# Altium project iris-fpc-set1.PrjPcb
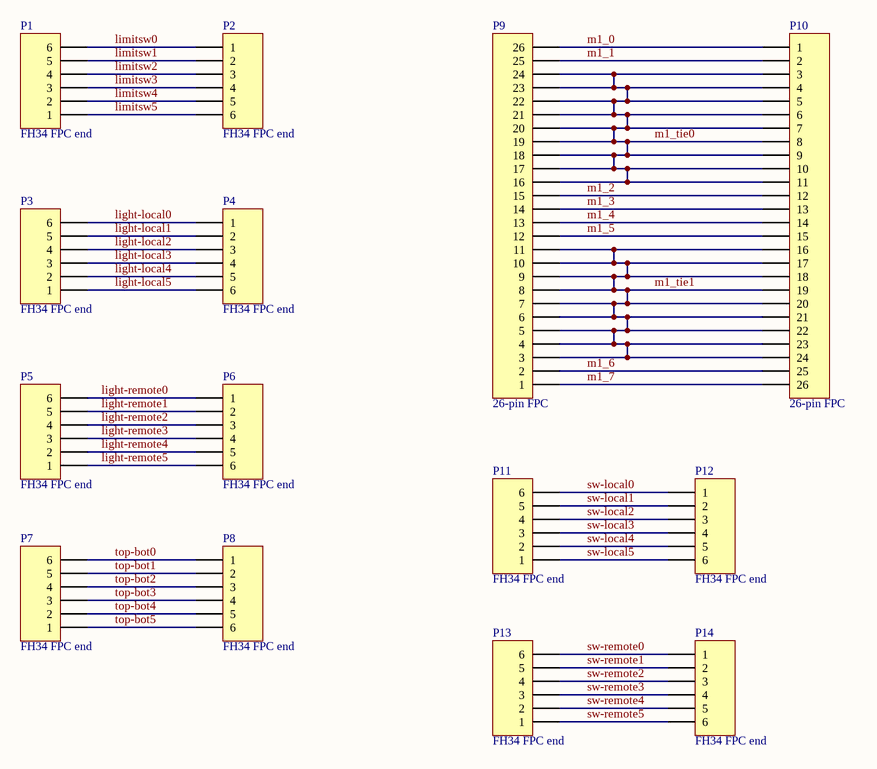
[diagram p0: wires.SchDoc]
1 sheet, 14 parts. Net scope: global (net labels, ports and power ports of the same name join across sheets).
Board file: iris-fpc-set1.PcbDoc

## Sheet wires.SchDoc
size A3; SheetNumber: 1; SheetTotal: 1

### Parts
P1  FH34 FPC end  [FPC-06-0.5MMP-0.3T-2.5MMS]
P2  FH34 FPC end  [FPC-06-0.5MMP-0.3T-2.5MMS]
P3  FH34 FPC end  [FPC-06-0.5MMP-0.3T-2.5MMS]
P4  FH34 FPC end  [FPC-06-0.5MMP-0.3T-2.5MMS]
P5  FH34 FPC end  [FPC-06-0.5MMP-0.3T-2.5MMS]
P6  FH34 FPC end  [FPC-06-0.5MMP-0.3T-2.5MMS]
P7  FH34 FPC end  [FPC-06-0.5MMP-0.3T-2.5MMS]
P8  FH34 FPC end  [FPC-06-0.5MMP-0.3T-2.5MMS]
P9  26-pin FPC  [FPC-26-0.5MMP-0.3T-2.5MMS]
P10  26-pin FPC  [FPC-26-0.5MMP-0.3T-2.5MMS]
P11  FH34 FPC end  [FPC-06-0.5MMP-0.3T-2.5MMS]
P12  FH34 FPC end  [FPC-06-0.5MMP-0.3T-2.5MMS]
P13  FH34 FPC end  [FPC-06-0.5MMP-0.3T-2.5MMS]
P14  FH34 FPC end  [FPC-06-0.5MMP-0.3T-2.5MMS]

### Nets
light-local0: P3.6 P4.1
light-local1: P3.5 P4.2
light-local2: P3.4 P4.3
light-local3: P3.3 P4.4
light-local4: P3.2 P4.5
light-local5: P3.1 P4.6
light-remote0: P5.6 P6.1
light-remote1: P5.5 P6.2
light-remote2: P5.4 P6.3
light-remote3: P5.3 P6.4
light-remote4: P5.2 P6.5
light-remote5: P5.1 P6.6
limitsw0: P1.6 P2.1
limitsw1: P1.5 P2.2
limitsw2: P1.4 P2.3
limitsw3: P1.3 P2.4
limitsw4: P1.2 P2.5
limitsw5: P1.1 P2.6
m1_0: P9.26 P10.1
m1_1: P9.25 P10.2
m1_2: P9.15 P10.12
m1_3: P9.14 P10.13
m1_4: P9.13 P10.14
m1_5: P9.12 P10.15
m1_6: P9.2 P10.25
m1_7: P9.1 P10.26
m1_tie0: P9.16 P9.17 P9.18 P9.19 P9.20 P9.21 P9.22 P9.23 P9.24 P10.3 P10.4 P10.5 P10.6 P10.7 P10.8 P10.9 P10.10 P10.11
m1_tie1: P9.3 P9.4 P9.5 P9.6 P9.7 P9.8 P9.9 P9.10 P9.11 P10.16 P10.17 P10.18 P10.19 P10.20 P10.21 P10.22 P10.23 P10.24
sw-local0: P11.6 P12.1
sw-local1: P11.5 P12.2
sw-local2: P11.4 P12.3
sw-local3: P11.3 P12.4
sw-local4: P11.2 P12.5
sw-local5: P11.1 P12.6
sw-remote0: P13.6 P14.1
sw-remote1: P13.5 P14.2
sw-remote2: P13.4 P14.3
sw-remote3: P13.3 P14.4
sw-remote4: P13.2 P14.5
sw-remote5: P13.1 P14.6
top-bot0: P7.6 P8.1
top-bot1: P7.5 P8.2
top-bot2: P7.4 P8.3
top-bot3: P7.3 P8.4
top-bot4: P7.2 P8.5
top-bot5: P7.1 P8.6

### Library data of the parts
P1-P8 P11-P14 = Header 6: Header, 6-Pin; MPN: FH34SRJ-6S-0.5SH(50); MYPN: J-FH34SRJ-6S-0.5SH(50); VENDOR: HRS; LatestRevisionDate: 17-Jul-2002; LatestRevisionNote: Re-released for DXP Platform.; Publisher: Altium Limited
P9 P10 = FPC-26: 26 Pin FPC header; MPN: FH34SRJ-26S-0.5SH(99); MYPN: J-FPC-0.5mm-26-0.3mm-T/B; VENDOR: Hirose; System: Connector